# Altium project MOTHERBOARD_hristo.PrjPcb (part 2 of 2)
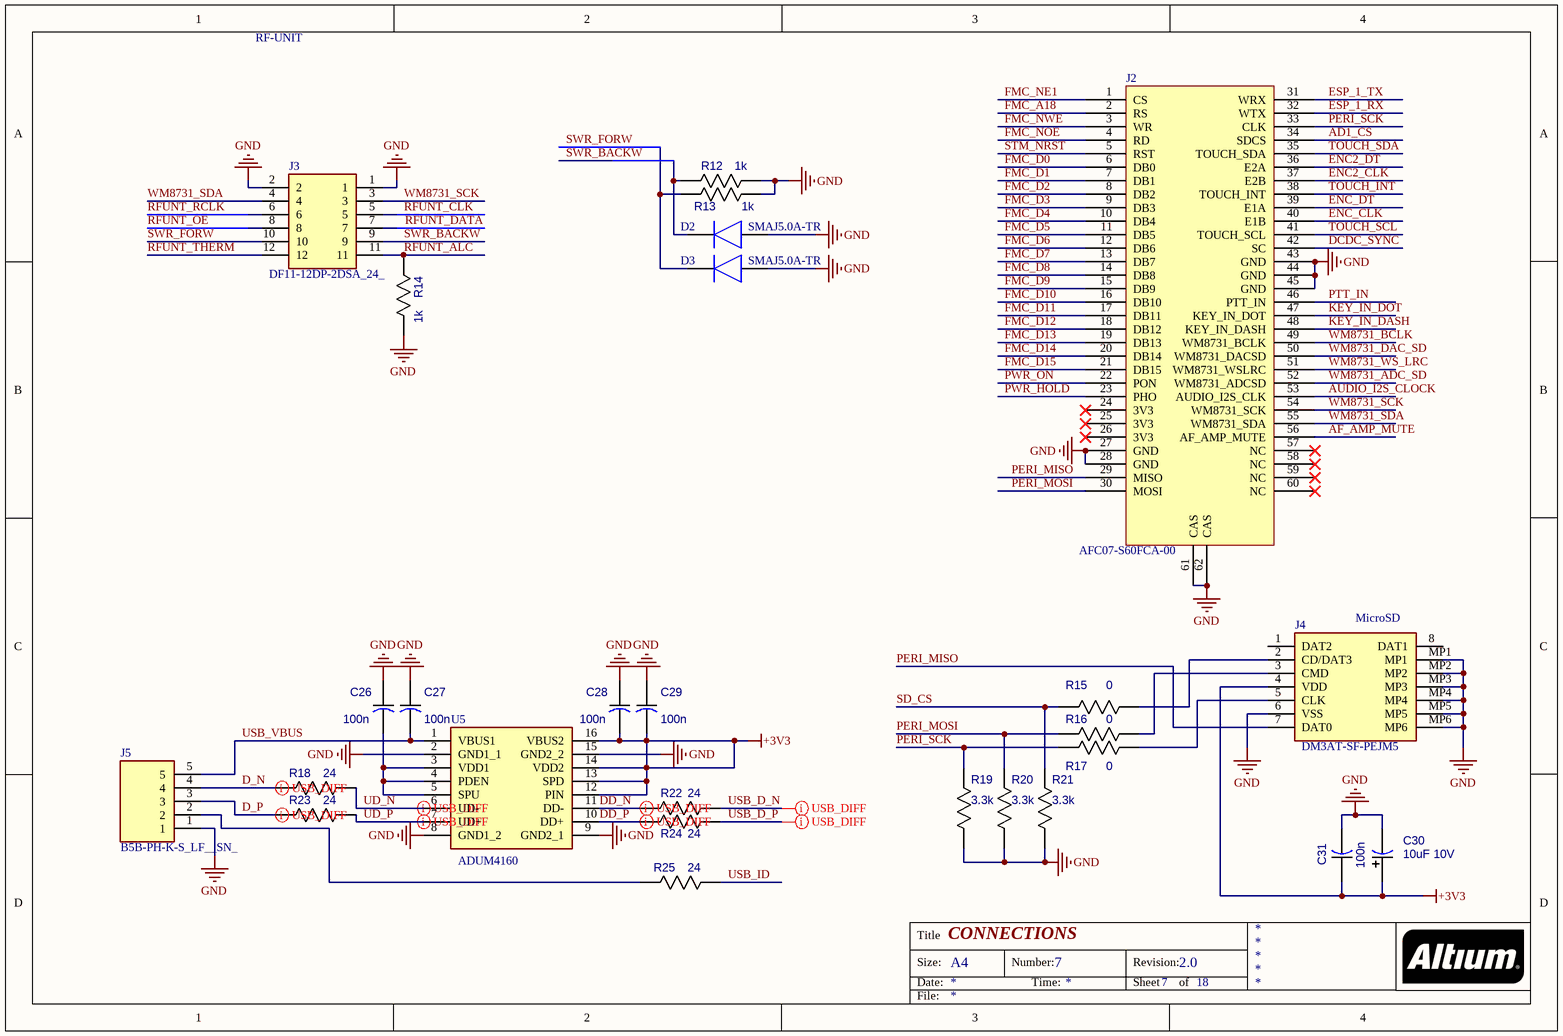
[diagram p8: CONNECTIONS.SchDoc]

## Nets that join several sheets
+1V2: FPGA (26 pins), POWER (C96.1 C100.2 U16.4)
+2V5: FPGA (8 pins), POWER (C94.2 C99.1 U15.4 U16.3)
+3V3: FPGA (28 pins), POWER (11 pins), STM32 (27 pins), CLOCK_GENERATOR (R9.1 R11.1), CONNECTIONS (9 pins)
+5: ADC (C5.1 C7.2 U1.1 U1.2), DAC (C36.2 C37.1 U7.1 U7.3), POWER (8 pins), CLOCK_GENERATOR (L3.1)
+12: DAC (5 pins), POWER (C97.1 C102.2 U14.3)
CLK_122.88M_N: ADC (U2.13), FPGA (U11.88), CLOCK_GENERATOR (R10.1 R11.2 XG1.5)
CLK_122.88M_P: ADC (U2.12), FPGA (U11.89), CLOCK_GENERATOR (R8.1 R9.2 XG1.4)
GND: ADC (39 pins), DAC (53 pins), FPGA (45 pins), POWER (41 pins), STM32 (27 pins), CLOCK_GENERATOR (14 pins), CONNECTIONS (35 pins)
AD1_CS: STM32 (U18.65), CONNECTIONS (J2.34)
AF_AMP_MUTE: STM32 (U18.87), CONNECTIONS (J2.56)
AUDIO_48K_CLOCK: FPGA (U11.136), STM32 (U18.32)
AUDIO_I2S_CLOCK: FPGA (U11.135), STM32 (U18.66), CONNECTIONS (J2.53)
CHARGE_PUMP: FPGA (U11.132), CLOCK_GENERATOR (C17.2 R5.1 R6.1)
CLKOUTA: ADC (U2.41), FPGA (U11.90)
DA0: ADC (U2.42), FPGA (U11.68)
DA1: ADC (U2.43), FPGA (U11.67)
DA2: ADC (U2.44), FPGA (U11.66)
DA3: ADC (U2.45), FPGA (U11.65)
DA4: ADC (U2.46), FPGA (U11.64)
DA5: ADC (U2.47), FPGA (U11.60)
DA6: ADC (U2.48), FPGA (U11.59)
DA7: ADC (U2.51), FPGA (U11.58)
DA8: ADC (U2.52), FPGA (U11.55)
DA9: ADC (U2.53), FPGA (U11.54)
DA10: ADC (U2.54), FPGA (U11.53)
DA11: ADC (U2.55), FPGA (U11.52)
DA12: ADC (U2.56), FPGA (U11.51)
DA13: ADC (U2.57), FPGA (U11.50)
DA14: ADC (U2.58), FPGA (U11.49)
DA15: ADC (U2.59), FPGA (U11.46)
DAC1: DAC (U6.16), FPGA (U11.101)
DAC2: DAC (U6.15), FPGA (U11.103)
DAC3: DAC (U6.14), FPGA (U11.104)
DAC4: DAC (U6.13), FPGA (U11.105)
DAC5: DAC (U6.12), FPGA (U11.106)
DAC6: DAC (U6.11), FPGA (U11.110)
DAC7: DAC (U6.10), FPGA (U11.111)
DAC8: DAC (U6.9), FPGA (U11.112)
DAC9: DAC (U6.8), FPGA (U11.113)
DAC10: DAC (U6.7), FPGA (U11.114)
DAC11: DAC (U6.6), FPGA (U11.115)
DAC12: DAC (U6.5), FPGA (U11.119)
DAC13: DAC (U6.4), FPGA (U11.120)
DAC14: DAC (U6.3), FPGA (U11.121)
DAC_CLK: DAC (R30.1), FPGA (U11.125)
DAC_DIV0: DAC (U6.28), FPGA (U11.85)
DAC_DIV1: DAC (U6.27), FPGA (U11.86)
DAC_DRV_A0: DAC (R43.1), FPGA (U11.76)
DAC_DRV_A1: DAC (R44.1), FPGA (U11.77)
DAC_HP1: DAC (U6.17), FPGA (U11.99)
DAC_HP2: DAC (U6.18), FPGA (U11.98)
DAC_PD: DAC (U6.36), FPGA (U11.100)
DAC_X4: DAC (U6.23), FPGA (U11.87)
DCDC_SYNC: FPGA (U11.133), POWER (U12.5), CONNECTIONS (J2.42)
DITH: ADC (U2.20), FPGA (U11.71)
ENC2_CLK: STM32 (R55.1 U18.7), CONNECTIONS (J2.37)
ENC2_DT: STM32 (R56.1 U18.3), CONNECTIONS (J2.36)
ENC_CLK: STM32 (U18.51), CONNECTIONS (J2.40)
ENC_DT: STM32 (U18.4), CONNECTIONS (J2.39)
ESP_1_RX: STM32 (U18.64), CONNECTIONS (J2.32)
ESP_1_TX: STM32 (U18.63), CONNECTIONS (J2.31)
FMC_A18: STM32 (U18.60), CONNECTIONS (J2.2)
FMC_D0: STM32 (U18.61), CONNECTIONS (J2.6)
FMC_D1: STM32 (U18.62), CONNECTIONS (J2.7)
FMC_D2: STM32 (U18.81), CONNECTIONS (J2.8)
FMC_D3: STM32 (U18.82), CONNECTIONS (J2.9)
FMC_D4: STM32 (U18.37), CONNECTIONS (J2.10)
FMC_D5: STM32 (U18.38), CONNECTIONS (J2.11)
FMC_D6: STM32 (U18.39), CONNECTIONS (J2.12)
FMC_D7: STM32 (U18.40), CONNECTIONS (J2.13)
FMC_D8: STM32 (U18.41), CONNECTIONS (J2.14)
FMC_D9: STM32 (U18.42), CONNECTIONS (J2.15)
FMC_D10: STM32 (U18.43), CONNECTIONS (J2.16)
FMC_D11: STM32 (U18.44), CONNECTIONS (J2.17)
FMC_D12: STM32 (U18.45), CONNECTIONS (J2.18)
FMC_D13: STM32 (U18.55), CONNECTIONS (J2.19)
FMC_D14: STM32 (U18.56), CONNECTIONS (J2.20)
FMC_D15: STM32 (U18.57), CONNECTIONS (J2.21)
FMC_NE1: STM32 (U18.88), CONNECTIONS (J2.1)
FMC_NOE: STM32 (U18.85), CONNECTIONS (J2.4)
FMC_NWE: STM32 (U18.86), CONNECTIONS (J2.3)
FPGA_BUS_D0: FPGA (U11.31), STM32 (U18.22)
FPGA_BUS_D1: FPGA (U11.30), STM32 (U18.23)
FPGA_BUS_D2: FPGA (U11.28), STM32 (U18.24)
FPGA_BUS_D3: FPGA (U11.144), STM32 (U18.25)
FPGA_BUS_D4: FPGA (U11.143), STM32 (U18.28)
FPGA_BUS_D5: FPGA (U11.142), STM32 (U18.29)
FPGA_BUS_D6: FPGA (U11.141), STM32 (U18.30)
FPGA_BUS_D7: FPGA (U11.137), STM32 (U18.31)
FPGA_CLK: FPGA (U11.33), STM32 (U18.17)
FPGA_SYNC: FPGA (U11.32), STM32 (U18.18)
KEY_IN_DASH: STM32 (U18.97), CONNECTIONS (J2.48)
KEY_IN_DOT: STM32 (U18.98), CONNECTIONS (J2.47)
OFA: ADC (U2.60), FPGA (U11.44)
PERI_MISO: STM32 (U17.2 U18.53), CONNECTIONS (J2.29 J4.7)
PERI_MOSI: STM32 (U17.5 U18.54), CONNECTIONS (J2.30 R16.2 R20.2)
PERI_SCK: STM32 (R58.2 U18.52), CONNECTIONS (J2.33 R17.2 R19.2)
PGA: ADC (U2.64), FPGA (U11.42)
PREAMP: ADC (R4.2), FPGA (U11.69)
PTT_IN: STM32 (U18.91), CONNECTIONS (J2.46)
PWR_HOLD: STM32 (U18.83), CONNECTIONS (J2.23)
PWR_ON: STM32 (U18.2), CONNECTIONS (J2.22)
RAND: ADC (U2.63), FPGA (U11.43)
RFUNT_ALC: STM32 (U18.35), CONNECTIONS (J3.11 R14.1)
RFUNT_CLK: STM32 (U18.1), CONNECTIONS (J3.5)
RFUNT_DATA: STM32 (U18.5), CONNECTIONS (J3.7)
RFUNT_OE: STM32 (U18.93), CONNECTIONS (J3.8)
RFUNT_RCLK: STM32 (U18.90), CONNECTIONS (J3.6)
RFUNT_THERM: STM32 (U18.33), CONNECTIONS (J3.12)
SD_CS: STM32 (U18.84), CONNECTIONS (R15.2 R21.2)
SHDN: ADC (U2.19), FPGA (U11.72)
STM_NRST: STM32 (C113.2 JTAG_STM.1 R65.1 U18.14), CONNECTIONS (J2.5)
SWR_BACKW: STM32 (U18.16), CONNECTIONS (D2.1 J3.9 R12.1)
SWR_FORW: STM32 (U18.15), CONNECTIONS (D3.1 J3.10 R13.1)
TCXO_CLK: FPGA (U11.126), CLOCK_GENERATOR (XG2.3)
TOUCH_INT: STM32 (U18.67), CONNECTIONS (J2.38)
TOUCH_SCL: STM32 (U18.95), CONNECTIONS (J2.41)
TOUCH_SDA: STM32 (U18.96), CONNECTIONS (J2.35)
USB_D_N: STM32 (U18.70), CONNECTIONS (R22.2)
USB_D_P: STM32 (U18.71), CONNECTIONS (R24.2)
USB_ID: STM32 (U18.69), CONNECTIONS (R25.2)
USB_VBUS: STM32 (U18.68), CONNECTIONS (C27.2 J5.5 U5.1)
WM8731_ADC_SD: STM32 (U18.79), CONNECTIONS (J2.52)
WM8731_BCLK: STM32 (U18.78), CONNECTIONS (J2.49)
WM8731_DAC_SD: STM32 (U18.80), CONNECTIONS (J2.50)
WM8731_SCK: STM32 (U18.46), CONNECTIONS (J2.54 J3.3)
WM8731_SDA: STM32 (U18.47), CONNECTIONS (J2.55 J3.4)
WM8731_WS_LRC: STM32 (U18.77), CONNECTIONS (J2.51)